# EAGLE schematic FullInstr (EAGLE 7.4.0)
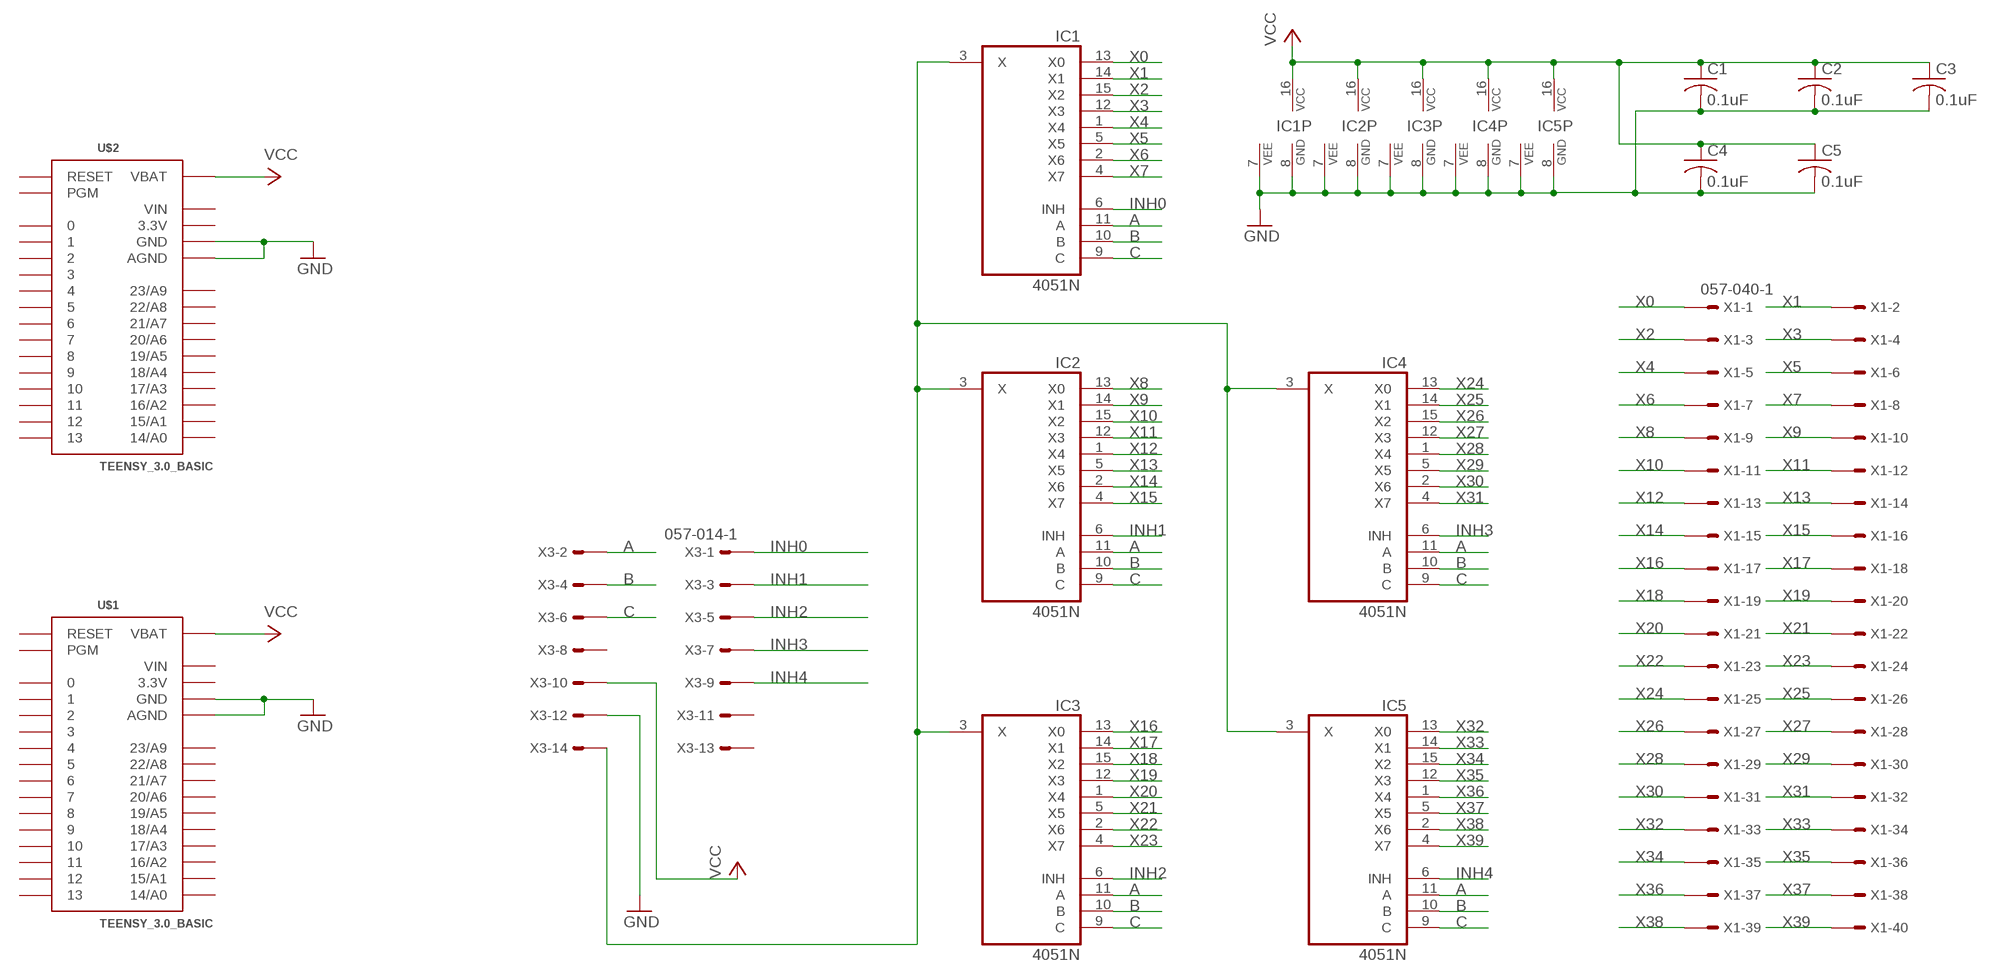
[diagram p0: schematic, sheet 1]

## Parts
C1  0.1uF  C-US025-025X050  [C025-025X050]
C2  0.1uF  C-US025-025X050  [C025-025X050]
C3  0.1uF  C-US025-025X050  [C025-025X050]
C4  0.1uF  C-US025-025X050  [C025-025X050]
C5  0.1uF  C-US025-025X050  [C025-025X050]
IC1  4051N  [DIL16]
IC2  4051N  [DIL16]
IC3  4051N  [DIL16]
IC4  4051N  [DIL16]
IC5  4051N  [DIL16]
U$1  TEENSY_3.0_BASIC  [TEENSY_3.0_BASIC]
U$2  TEENSY_3.0_BASIC  [TEENSY_3.0_BASIC]
X1  057-040-1  [057-040-1]
X3  057-014-1  [057-014-1]

## Nets
A: IC1.11(A) IC2.11(A) IC3.11(A) IC4.11(A) IC5.11(A) X3.2
B: IC1.10(B) IC2.10(B) IC3.10(B) IC4.10(B) IC5.10(B) X3.4
C: IC1.9(C) IC2.9(C) IC3.9(C) IC4.9(C) IC5.9(C) X3.6
GND [ground]: C1.2 C2.2 C3.2 C4.2 C5.2 IC1.7(VEE) IC1.8(GND) IC2.7(VEE) IC2.8(GND) IC3.7(VEE) IC3.8(GND) IC4.7(VEE) IC4.8(GND) IC5.7(VEE) IC5.8(GND) U$1.AGND U$1.GND U$1.GND1(GND) U$2.AGND U$2.GND U$2.GND1(GND) X3.12
INH0: IC1.6(INH) X3.1
INH1: IC2.6(INH) X3.3
INH2: IC3.6(INH) X3.5
INH3: IC4.6(INH) X3.7
INH4: IC5.6(INH) X3.9
N$2: IC1.3(X) IC2.3(X) IC3.3(X) IC4.3(X) IC5.3(X) X3.14
VCC [ground]: C1.1 C2.1 C3.1 C4.1 C5.1 IC1.16(VCC) IC2.16(VCC) IC3.16(VCC) IC4.16(VCC) IC5.16(VCC) U$1.VBAT U$2.VBAT X3.10
X0: IC1.13(X0) X1.1
X1: IC1.14(X1) X1.2
X2: IC1.15(X2) X1.3
X3: IC1.12(X3) X1.4
X4: IC1.1(X4) X1.5
X5: IC1.5(X5) X1.6
X6: IC1.2(X6) X1.7
X7: IC1.4(X7) X1.8
X8: IC2.13(X0) X1.9
X9: IC2.14(X1) X1.10
X10: IC2.15(X2) X1.11
X11: IC2.12(X3) X1.12
X12: IC2.1(X4) X1.13
X13: IC2.5(X5) X1.14
X14: IC2.2(X6) X1.15
X15: IC2.4(X7) X1.16
X16: IC3.13(X0) X1.17
X17: IC3.14(X1) X1.18
X18: IC3.15(X2) X1.19
X19: IC3.12(X3) X1.20
X20: IC3.1(X4) X1.21
X21: IC3.5(X5) X1.22
X22: IC3.2(X6) X1.23
X23: IC3.4(X7) X1.24
X24: IC4.13(X0) X1.25
X25: IC4.14(X1) X1.26
X26: IC4.15(X2) X1.27
X27: IC4.12(X3) X1.28
X28: IC4.1(X4) X1.29
X29: IC4.5(X5) X1.30
X30: IC4.2(X6) X1.31
X31: IC4.4(X7) X1.32
X32: IC5.13(X0) X1.33
X33: IC5.14(X1) X1.34
X34: IC5.15(X2) X1.35
X35: IC5.12(X3) X1.36
X36: IC5.1(X4) X1.37
X37: IC5.5(X5) X1.38
X38: IC5.2(X6) X1.39
X39: IC5.4(X7) X1.40
Unconnected: U$1.0 U$1.1 U$1.2 U$1.3 U$1.4 U$1.5 U$1.6 U$1.7 U$1.8 U$1.9 U$1.10 U$1.11 U$1.12 U$1.13 U$1.14/A0 U$1.15/A1 U$1.16/A2 U$1.17/A3 U$1.18/A4 U$1.19/A5 U$1.20/A6 U$1.21/A7 U$1.22/A8 U$1.23/A9 U$1.PGM U$1.RESET U$2.0 U$2.1 U$2.2 U$2.3 U$2.4 U$2.5 U$2.6 U$2.7 U$2.8 U$2.9 U$2.10 U$2.11 U$2.12 U$2.13 U$2.14/A0 U$2.15/A1 U$2.16/A2 U$2.17/A3 U$2.18/A4 U$2.19/A5 U$2.20/A6 U$2.21/A7 U$2.22/A8 U$2.23/A9 U$2.PGM U$2.RESET X3.8 X3.11 X3.13

## Power pins joined to a net without a drawn wire
3.3V: U$1.3.3V U$1.3.3V1(3.3V) U$2.3.3V U$2.3.3V1(3.3V)
VIN: U$1.VIN U$2.VIN

## Library data of the parts
C1-C5 = rcl:C-US: CAPACITOR, American symbol
IC1-IC5 = 40xx:4051: 8-channel ANALOG MULTIPLEXER
U$1 U$2 = Teensy3.0:TEENSY_3.0_BASIC: Basic Teensy 3.0 with none of the 'inner' pins enabled. See '+4', 'AllAnalogPins", and 'AllPins' packages for additional pin holes, as needed.
X1 = con-panduit:057-040-: CONNECTOR 40-pin series 057 contact pc board low profile headers; OC_FARNELL: unknown; OC_NEWARK: unknown
X3 = con-panduit:057-014-: CONNECTOR 10-pin series 057 contact pc board low profile headers; OC_FARNELL: unknown; OC_NEWARK: unknown

## Net classes
0 default: width 0.203 mm
1 ground: width 0.406 mm